# Altium schematic sheet ECU_Freio_2024_Equipe_Imperador.SchDoc
size A4; SheetNumber: 1; SheetTotal: 1
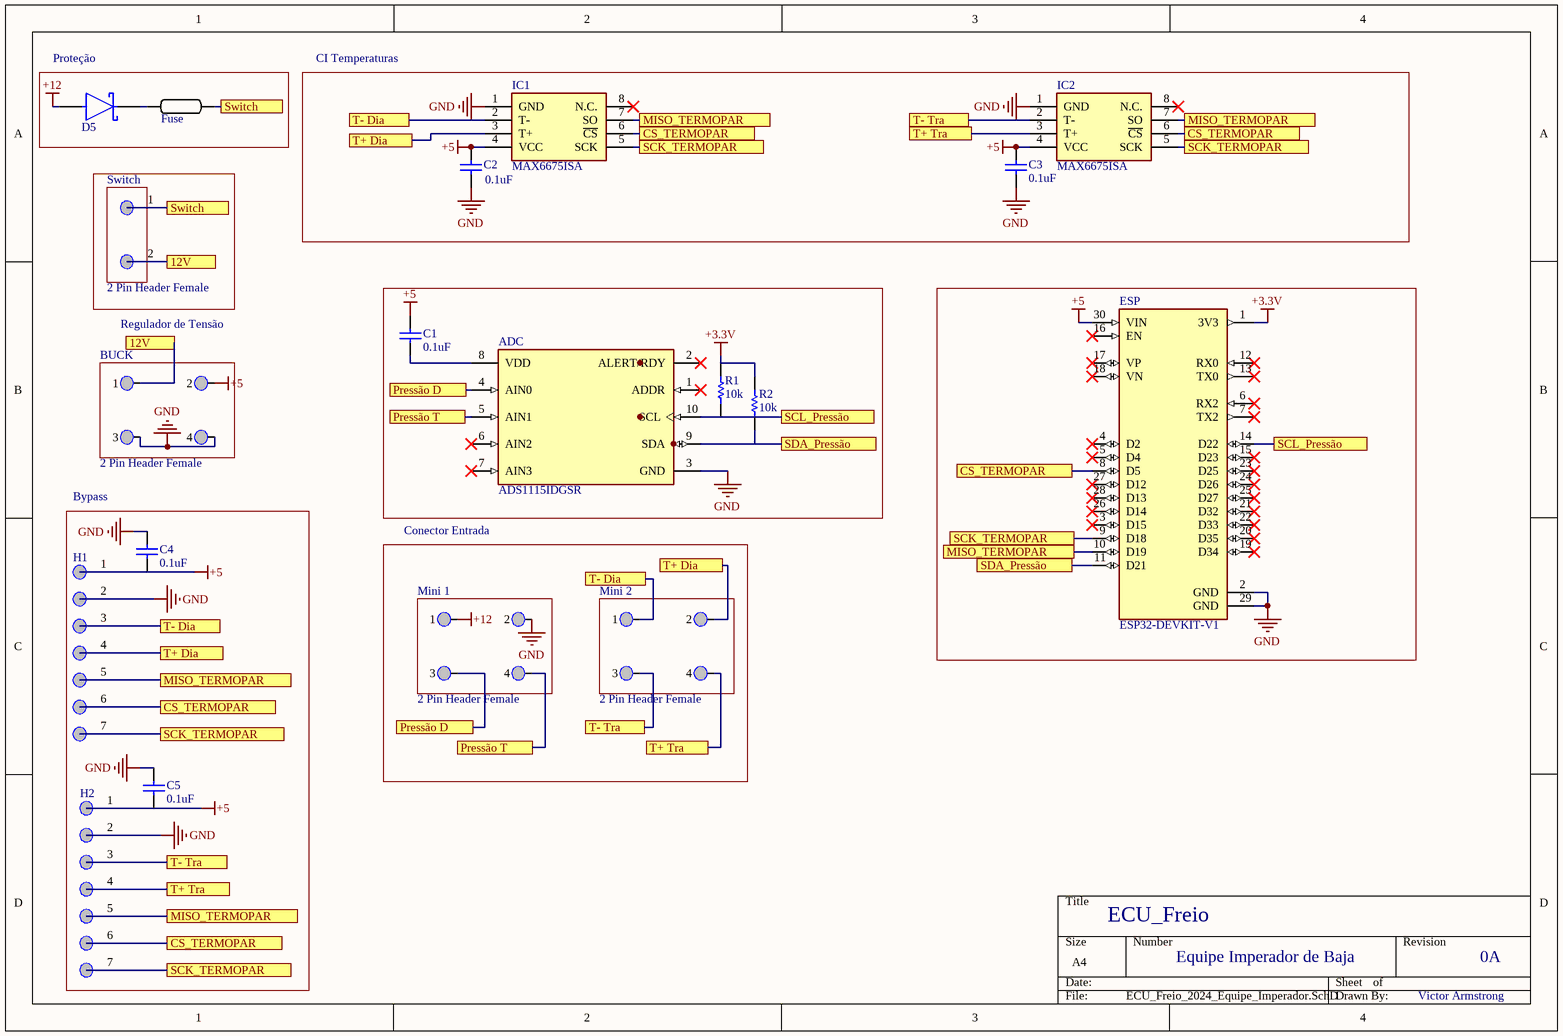
[diagram p0: ECU_Freio_2024_Equipe_Imperador.SchDoc]

## Parts
ADC  ADS1115IDGSR  [FP-DGS0010A-IPC_B]
BUCK  2 Pin Header Female  [CONECTOR MINIFIT 2X2]
C1  0.1uF  [CAPC2013X145X50ML20T25]
C2  0.1uF  [CAPC2013X145X50ML20T25]
C3  0.1uF  [CAPC2013X145X50ML20T25]
C4  0.1uF  [CAPC2013X145X50ML20T25]
C5  0.1uF  [CAPC2013X145X50ML20T25]
D5  BAT54JFILM  [FP-SOD323-MFG]  (value not drawn)
ESP  ESP32-DEVKIT-V1  [MODULE_ESP32_DEVKIT_V1]
Fuse  Fuse Holder 5x20mm  [Fuse Holder 5x20mm]  (value not drawn)
H1  CONECTOR JST XH 6 PIN_1  [7 Furos]  (value not drawn)
H2  CONECTOR JST XH 6 PIN_1  [7 Furos]  (value not drawn)
IC1  MAX6675ISA  [SOIC127P600X175-8N]
IC2  MAX6675ISA  [SOIC127P600X175-8N]
Mini_1  2 Pin Header Female  [CONECTOR MINIFIT 2X2]
Mini_2  2 Pin Header Female  [CONECTOR MINIFIT 2X2]
R1  10k  [RESC2013X60X35ML10T20]
R2  10k  [RESC2013X60X35ML10T20]
Switch  2 Pin Header Female  [2 Pins Header Female - duplicate]

## Blocks framed on the sheet
Proteção: D5 Fuse
CI Temperaturas: C2 C3 IC1 IC2
Bypass: C4 C5 H1 H2
Conector Entrada: Mini_1 Mini_2

## Ports
12V (see ECU_Freio_2024_Equipe_Imperador[1B]), CS_TERMOPAR (see ECU_Freio_2024_Equipe_Imperador[1C], ECU_Freio_2024_Equipe_Imperador[2A], ECU_Freio_2024_Equipe_Imperador[3B], ECU_Freio_2024_Equipe_Imperador[4A]), CS_TERMOPAR (see ECU_Freio_2024_Equipe_Imperador[1D], ECU_Freio_2024_Equipe_Imperador[2A], ECU_Freio_2024_Equipe_Imperador[3B], ECU_Freio_2024_Equipe_Imperador[4A]), CS_TERMOPAR (see ECU_Freio_2024_Equipe_Imperador[2A], ECU_Freio_2024_Equipe_Imperador[3B]), CS_TERMOPAR (see ECU_Freio_2024_Equipe_Imperador[2A], ECU_Freio_2024_Equipe_Imperador[4A]), CS_TERMOPAR (see ECU_Freio_2024_Equipe_Imperador[3B], ECU_Freio_2024_Equipe_Imperador[4A]), MISO_TERMOPAR (see ECU_Freio_2024_Equipe_Imperador[1C], ECU_Freio_2024_Equipe_Imperador[2A], ECU_Freio_2024_Equipe_Imperador[3C], ECU_Freio_2024_Equipe_Imperador[4A]), MISO_TERMOPAR (see ECU_Freio_2024_Equipe_Imperador[1D], ECU_Freio_2024_Equipe_Imperador[2A], ECU_Freio_2024_Equipe_Imperador[3C], ECU_Freio_2024_Equipe_Imperador[4A]), MISO_TERMOPAR (see ECU_Freio_2024_Equipe_Imperador[2A], ECU_Freio_2024_Equipe_Imperador[3C]), MISO_TERMOPAR (see ECU_Freio_2024_Equipe_Imperador[2A], ECU_Freio_2024_Equipe_Imperador[4A]), MISO_TERMOPAR (see ECU_Freio_2024_Equipe_Imperador[3C], ECU_Freio_2024_Equipe_Imperador[4A]), Pressão D (see ECU_Freio_2024_Equipe_Imperador[1B]), Pressão D (see ECU_Freio_2024_Equipe_Imperador[2C]), Pressão T (see ECU_Freio_2024_Equipe_Imperador[1B]), Pressão T (see ECU_Freio_2024_Equipe_Imperador[2C]), SCK_TERMOPAR (see ECU_Freio_2024_Equipe_Imperador[1C], ECU_Freio_2024_Equipe_Imperador[2A], ECU_Freio_2024_Equipe_Imperador[3C], ECU_Freio_2024_Equipe_Imperador[4A]), SCK_TERMOPAR (see ECU_Freio_2024_Equipe_Imperador[1D], ECU_Freio_2024_Equipe_Imperador[2A], ECU_Freio_2024_Equipe_Imperador[3C], ECU_Freio_2024_Equipe_Imperador[4A]), SCK_TERMOPAR (see ECU_Freio_2024_Equipe_Imperador[2A], ECU_Freio_2024_Equipe_Imperador[3C]), SCK_TERMOPAR (see ECU_Freio_2024_Equipe_Imperador[2A], ECU_Freio_2024_Equipe_Imperador[4A]), SCK_TERMOPAR (see ECU_Freio_2024_Equipe_Imperador[3C], ECU_Freio_2024_Equipe_Imperador[4A]), SCL_Pressão (see ECU_Freio_2024_Equipe_Imperador[2B]), SCL_Pressão (see ECU_Freio_2024_Equipe_Imperador[4B]), SDA_Pressão (see ECU_Freio_2024_Equipe_Imperador[2B]), SDA_Pressão (see ECU_Freio_2024_Equipe_Imperador[3C]), Switch (see ECU_Freio_2024_Equipe_Imperador[1A]), T+ Dia (see ECU_Freio_2024_Equipe_Imperador[1A], ECU_Freio_2024_Equipe_Imperador[1C]), T+ Dia (see ECU_Freio_2024_Equipe_Imperador[1A], ECU_Freio_2024_Equipe_Imperador[2C]), T+ Dia (see ECU_Freio_2024_Equipe_Imperador[2C]), T+ Tra (see ECU_Freio_2024_Equipe_Imperador[1D], ECU_Freio_2024_Equipe_Imperador[3A]), T+ Tra (see ECU_Freio_2024_Equipe_Imperador[2C]), T+ Tra (see ECU_Freio_2024_Equipe_Imperador[2C], ECU_Freio_2024_Equipe_Imperador[3A]), T- Dia (see ECU_Freio_2024_Equipe_Imperador[1A], ECU_Freio_2024_Equipe_Imperador[1C]), T- Dia (see ECU_Freio_2024_Equipe_Imperador[1A], ECU_Freio_2024_Equipe_Imperador[2C]), T- Dia (see ECU_Freio_2024_Equipe_Imperador[2C]), T- Tra (see ECU_Freio_2024_Equipe_Imperador[1D], ECU_Freio_2024_Equipe_Imperador[3A]), T- Tra (see ECU_Freio_2024_Equipe_Imperador[2C]), T- Tra (see ECU_Freio_2024_Equipe_Imperador[2C], ECU_Freio_2024_Equipe_Imperador[3A])

## Nets
+3.3V: ESP.1(3V3) R1.1 R2.1
+5: BUCK.2 C1.1 C2.1 C3.1 C4.1 C5.1 ESP.30(VIN) H1.1 H2.1 IC1.4(VCC) IC2.4(VCC)
+12: D5.2(A) Mini_1.1
GND: ADC.3(GND) BUCK.3 BUCK.4 C2.2 C3.2 C4.2 C5.2 ESP.2(GND) ESP.29(GND) H1.2 H2.2 IC1.1(GND) IC2.1(GND) Mini_1.2
12V: BUCK.1 Switch.2 ; port 12V
CS_TERMOPAR: ESP.8(D5) H1.6 H2.6 IC1.6(~{CS}) IC2.6(~{CS}) ; port CS_TERMOPAR
MISO_TERMOPAR: ESP.10(D19) H1.5 H2.5 IC1.7(SO) IC2.7(SO) ; port MISO_TERMOPAR
Pressão D: ADC.4(AIN0) Mini_1.3 ; port Pressão D
Pressão T: ADC.5(AIN1) Mini_1.4 ; port Pressão T
SCK_TERMOPAR: ESP.9(D18) H1.7 H2.7 IC1.5(SCK) IC2.5(SCK) ; port SCK_TERMOPAR
SCL_Pressão: ADC.10(SCL) ESP.14(D22) R1.2 ; port SCL_Pressão
SDA_Pressão: ADC.9(SDA) ESP.11(D21) R2.2 ; port SDA_Pressão
Switch: Fuse.1 Switch.1 ; port Switch
T+ Dia: H1.4 IC1.3(T+) Mini_2.2 ; port T+ Dia
T+ Tra: H2.4 IC2.3(T+) Mini_2.4 ; port T+ Tra
T- Dia: H1.3 IC1.2(T-) Mini_2.1 ; port T- Dia
T- Tra: H2.3 IC2.2(T-) Mini_2.3 ; port T- Tra
NetADC_8: ADC.8(VDD) C1.2
NetD5_1: D5.1(C) Fuse.2

Not connected (* = marked no-connect by the designer): ADC 1(ADDR)* 2(ALERT/RDY)* 6(AIN2)* 7(AIN3)*; ESP 3(D15)* 4(D2)* 5(D4)* 6(RX2)* 7(TX2)* 12(RX0)* 13(TX0)* 15(D23)* 16(EN)* 17(VP)* 18(VN)* 19(D34)* 20(D35)* 21(D32)* 22(D33)* 23(D25)* 24(D26)* 25(D27)* 26(D14)* 27(D12)* 28(D13)*; IC1 8(N.C.)*; IC2 8(N.C.)*

## Notes on the sheet
- Regulador de Tensão
- ECU_Freio
- Equipe Imperador de Baja
- 0A
- Victor Armstrong

## Library data of the parts
ADC = CMP-0003-00385-3: IC ADC 16BIT SIGMA-DELTA 10VSSOP; Max Supply Voltage (DC): 5.5V; Resolution: 16b; Interface: I2C; Number of Inputs: 4; Sampling Rate: 860S/s; Integral Nonlinearity (INL): 1LSB; Min Supply Voltage: 2V; Polarity: Bipolar; Conversion Rate: 0.86KS/s; Supply Type: Single; Number of Converters: 1; Number of Bits: 16; Power Dissipation: 900uW; Case/Package: VSSOP; Contact Plating: Gold; RoHS Compliant: Yes; Max Operating Temperature: 125°C; Lead Free: Lead Free; Package Quantity: 2500; Series: -; Min Supply Voltage (DC): 2V; REACH SVHC: No SVHC; Packaging: Tape and Reel; Max Supply Voltage: 5.5V; Radiation Hardening: No; Min Operating Temperature: -40°C; Number of Pins: 10; Number of A/D Converters: 1
C1-C5 = CMP-1036-04819-2: Part Number: C0805C225K9PACTU; Manufacturer: Kemet
D5 = CMP-2000-05927-2: DIODE SCHOTTKY 40V 300MA SOD323; Manufacturer: STMicroelectronics; Max Surge Forward Current: 1.25A; Value: 7pF; Max Junction Temp: +150°C; Peak Reverse Current: 1uA; Standoff Height: 0mm; ComponentLink2Description: Datasheet; Device Class L2: Diodes; Mouser Description: Schottky Diodes & Rectifiers 300mA 40 Volt; Forward Current: 300mA; Temperature Range Low: -40°C; Temperature Range High: +150°C; Digikey Description: DIODE SCHOTTKY 40V 300MA SOD323; Capacitance: 7pF; Ipc Land Pattern Name: SOD250128X117-2; Automotive: No; Manufacturer Part Number: BAT54JFILM; Device Class L1: Discrete Semiconductors; Lead Free: Yes; ComponentLink2URL: https://www.st.com/resource/en/datasheet/bat54.pdf; Package: SOD323; Temperature: -40°C to +150°C; Category: IC; Height: 1.17mm; Octopart: https://octopart.com/bat54jfilm-stmicroelectronics-326073; RoHS: TRUE; Device Class L3: Schottky Diodes; Max Repetitive Reverse Voltage: 40V
ESP = ESP32-DEVKIT-V1: Dual core, Wi-Fi: 2.4 GHz up to 150 Mbits/s,BLE (Bluetooth Low Energy) and legacy Bluetooth, 32 bits, Up to 240 MHz; MF: Do it; Price: None; Availability: Not in stock; Package: None; MP: ESP32-DEVKIT-V1; Value: *; SnapEDA_Link: https://www.snapeda.com/parts/ESP32-DEVKIT-V1/Do+it/view-part/?ref=snap; Check_prices: https://www.snapeda.com/parts/ESP32-DEVKIT-V1/Do+it/view-part/?ref=eda
IC1 IC2 = MAX6675ISA: Integrated Circuit; Manufacturer_Name: Analog Devices; Datasheet Link: http://datasheets.maximintegrated.com/en/ds/MAX6675.pdf; Height: 1.75mm; Manufacturer_Part_Number: MAX6675ISA; Mouser Part Number: N/A; Mouser Price/Stock: https://www.mouser.com/Search/Refine.aspx?Keyword=N%2FA
R1 R2 = CMP-2100-03671-1: Chip Resistor, 1 KOhm, +/- 1%, 125 mW, -55 to 155 degC, 0805 (2012 Metric), RoHS, Tape and Reel; Manufacturer: Yageo; Temperature Coefficient: 100ppm/degreesC; Voltage Rating (DC): 150V; Max Power Dissipation: 125mW; Resistance: 1KOhm; Number of Pins: 2; Number of Terminations: 2; Datasheet URL: http://www.yageo.com/NewPortal/yageodocoutput?fileName=/pdf/R-Chip/PYu-RC_Group_51_RoHS_L_5.pdf; Length: 0.079inch; Package Description: 2-Pin Surface Mounted Device, Body 2 x 1.25 mm; Depth: 1.25mm; Height: 0.024inch; Military Standard: Not; Case/Package: 0805; Package Reference: 0805; RoHSCompliant: true; Lead Free: LeadFree; Packaging: TapeandReel; Package Quantity: 1; Datasheet Version: Rev. 5, 10/2016; Tolerance: 1%; Min Operating Temperature: -55degC; Voltage Rating: 150V; Composition: ThickFilm; Case Code (Imperial): 0805; Power Rating: 125mW; Width: 0.049inch; Case Code (Metric): 2012; Manufacturer URL: http://www.yageo.com/; Max Operating Temperature: 155degC; REACH SVHC: Unknown; Termination: SMD/SMT
H1 H2 = CONECTOR JST XH 6 PIN_1: Value: CONECTOR JST XH 6 PIN